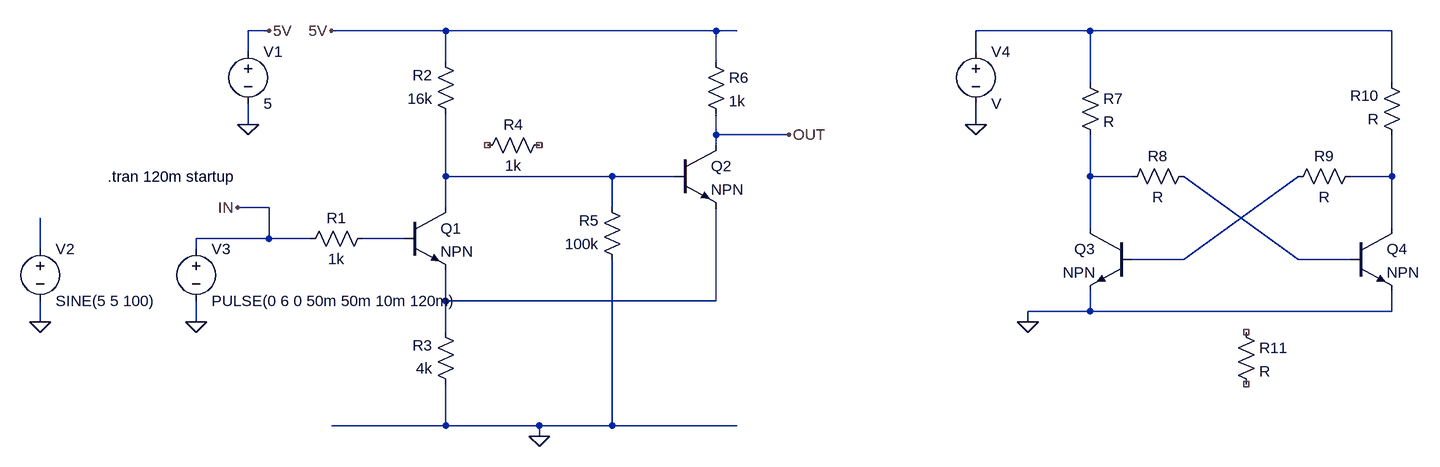
[diagram p0: schematic Schmitt Trigger for Cap Pulse V0.asc]
Schmitt Trigger for Cap Pulse V0.asc, the LTspice schematic file:
Version 4
SHEET 1 1616 680
WIRE -144 -128 -176 -128
WIRE 128 -128 -48 -128
WIRE 544 -128 128 -128
WIRE 576 -128 544 -128
WIRE 1120 -128 944 -128
WIRE 1584 -128 1120 -128
WIRE -176 -96 -176 -128
WIRE 944 -96 944 -128
WIRE 128 -80 128 -128
WIRE 544 -80 544 -128
WIRE 1120 -48 1120 -128
WIRE 1584 -48 1584 -128
WIRE -176 16 -176 -16
WIRE 944 16 944 -16
WIRE 544 32 544 0
WIRE 656 32 544 32
WIRE 544 48 544 32
WIRE 128 96 128 0
WIRE 384 96 128 96
WIRE 480 96 384 96
WIRE 1120 96 1120 32
WIRE 1184 96 1120 96
WIRE 1584 96 1584 32
WIRE 1584 96 1520 96
WIRE -144 144 -192 144
WIRE 128 144 128 96
WIRE 384 144 384 96
WIRE 1120 176 1120 96
WIRE 1584 176 1584 96
WIRE -144 192 -144 144
WIRE -144 192 -256 192
WIRE -80 192 -144 192
WIRE 64 192 0 192
WIRE -496 208 -496 160
WIRE -256 208 -256 192
WIRE 1264 224 1440 96
WIRE 1264 224 1184 224
WIRE 1440 224 1264 96
WIRE 1520 224 1440 224
WIRE 128 288 128 240
WIRE 544 288 544 144
WIRE 544 288 128 288
WIRE 1120 304 1120 272
WIRE 1120 304 1024 304
WIRE 1584 304 1584 272
WIRE 1584 304 1120 304
WIRE -496 320 -496 288
WIRE -256 320 -256 288
WIRE 1024 320 1024 304
WIRE 128 336 128 288
WIRE 128 480 128 416
WIRE 128 480 -48 480
WIRE 272 480 128 480
WIRE 384 480 384 224
WIRE 384 480 272 480
WIRE 576 480 384 480
WIRE 272 496 272 480
FLAG 272 496 0
FLAG -144 -128 5V
FLAG -176 16 0
FLAG -48 -128 5V
FLAG -192 144 IN
FLAG 656 32 OUT
FLAG -256 320 0
FLAG -496 320 0
FLAG 944 16 0
FLAG 1024 320 0
SYMBOL npn 64 144 R0
SYMATTR InstName Q1
SYMBOL npn 480 48 R0
SYMATTR InstName Q2
SYMBOL res 16 176 R90
WINDOW 0 0 56 VBottom 2
WINDOW 3 32 56 VTop 2
SYMATTR InstName R1
SYMATTR Value 1k
SYMBOL res 144 432 R180
WINDOW 0 36 76 Left 2
WINDOW 3 36 40 Left 2
SYMATTR InstName R3
SYMATTR Value 4k
SYMBOL res 144 16 R180
WINDOW 0 36 76 Left 2
WINDOW 3 36 40 Left 2
SYMATTR InstName R2
SYMATTR Value 16k
SYMBOL res 176 64 R270
WINDOW 0 32 56 VTop 2
WINDOW 3 0 56 VBottom 2
SYMATTR InstName R4
SYMATTR Value 1k
SYMBOL res 400 240 R180
WINDOW 0 36 76 Left 2
WINDOW 3 36 40 Left 2
SYMATTR InstName R5
SYMATTR Value 100k
SYMBOL voltage -176 -112 R0
WINDOW 123 0 0 Left 0
WINDOW 39 0 0 Left 0
SYMATTR InstName V1
SYMATTR Value 5
SYMBOL res 528 -96 R0
SYMATTR InstName R6
SYMATTR Value 1k
SYMBOL voltage -496 192 R0
WINDOW 123 0 0 Left 0
WINDOW 39 0 0 Left 0
SYMATTR InstName V2
SYMATTR Value SINE(5 5 100)
SYMBOL voltage -256 192 R0
WINDOW 123 0 0 Left 0
WINDOW 39 0 0 Left 0
SYMATTR InstName V3
SYMATTR Value PULSE(0 6 0 50m 50m 10m 120m)
SYMBOL res 1104 -64 R0
SYMATTR InstName R7
SYMBOL res 1280 80 R90
WINDOW 0 0 56 VBottom 2
WINDOW 3 32 56 VTop 2
SYMATTR InstName R8
SYMBOL res 1536 80 R90
WINDOW 0 0 56 VBottom 2
WINDOW 3 32 56 VTop 2
SYMATTR InstName R9
SYMBOL res 1600 48 R180
WINDOW 0 36 76 Left 2
WINDOW 3 36 40 Left 2
SYMATTR InstName R10
SYMBOL npn 1184 176 M0
SYMATTR InstName Q3
SYMBOL npn 1520 176 R0
SYMATTR InstName Q4
SYMBOL res 1344 320 R0
SYMATTR InstName R11
SYMBOL voltage 944 -112 R0
SYMATTR InstName V4
TEXT -392 96 Left 2 !.tran 120m startup

The netlist it stands for:
* Schmitt Trigger for Cap Pulse V0.asc
Q1 N002 N005 N009 0 NPN
Q2 OUT N002 N009 0 NPN
R1 N005 IN 1k
R3 0 N009 4k
R2 N002 5V 16k
R4 NC_01 NC_02 1k
R5 0 N002 100k
V1 5V 0 5
R6 5V OUT 1k
V2 N006 0 SINE(5 5 100)
V3 IN 0 PULSE(0 6 0 50m 50m 10m 120m)
R7 N001 N003 R
R8 N008 N003 R
R9 N004 N007 R
R10 N004 N001 R
Q3 N003 N007 0 0 NPN
Q4 N004 N008 0 0 NPN
R11 NC_03 NC_04 R
V4 N001 0 V
.model NPN NPN
.model PNP PNP
.lib standard.bjt
.tran 120m startup
.backanno
.end